# Altium schematic sheet Receiver.SchDoc
size A4
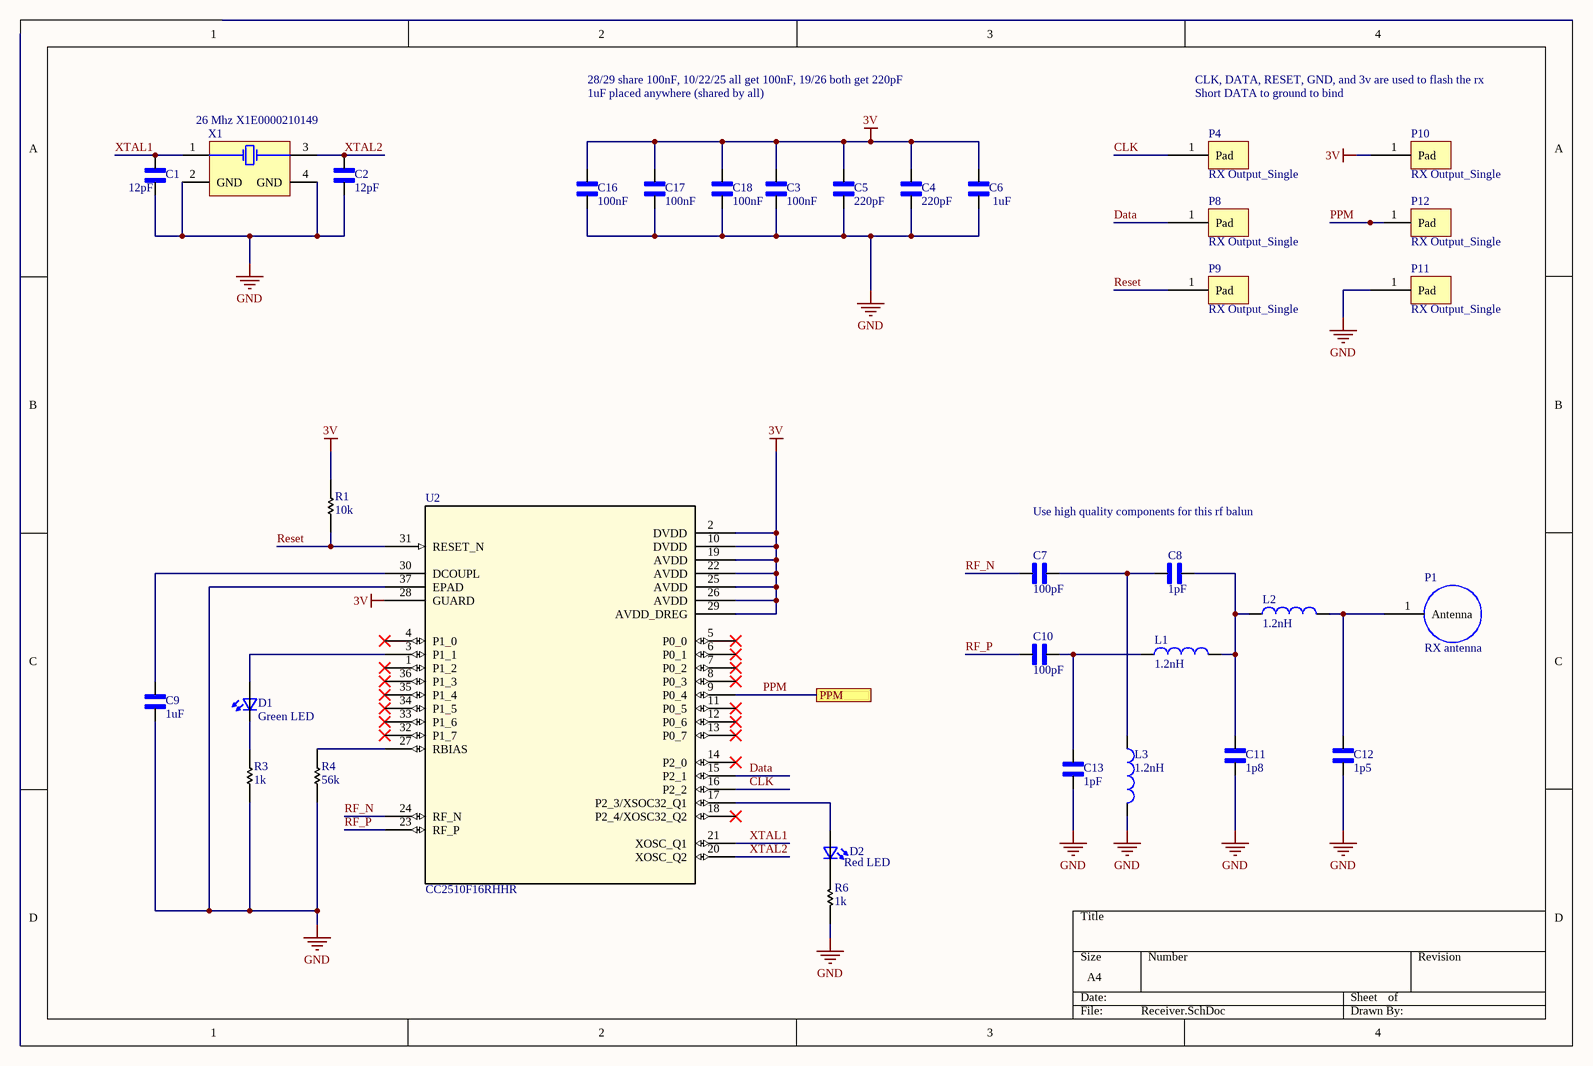
[diagram p0: Receiver.SchDoc]

## Parts
C1  12pF  [0402 Capacitor Generic]
C2  12pF  [0402 Capacitor Generic]
C3  100nF  [0402 Capacitor Generic]
C4  220pF  [0402 Capacitor Generic]
C5  220pF  [0402 Capacitor Generic]
C6  1uF  [0402 Capacitor Generic]
C7  100pF  [0402 Capacitor Generic]
C8  1pF  [0402 Capacitor Generic]
C9  1uF  [0402 Capacitor Generic]
C10  100pF  [0402 Capacitor Generic]
C11  1p8  [0402 Capacitor Generic]
C12  1p5  [0402 Capacitor Generic]
C13  1pF  [0402 Capacitor Generic]
C16  100nF  [0402 Capacitor Generic]
C17  100nF  [0402 Capacitor Generic]
C18  100nF  [0402 Capacitor Generic]
D1  Green LED  [0402 LED Generic]
D2  Red LED  [0402 LED Generic]
L1  1.2nH  [0402 Inductor Generic]
L2  1.2nH  [0402 Inductor Generic]
L3  1.2nH  [0402 Inductor Generic]
P1  RX antenna  [Antenna pad]
P4  RX Output_Single  [1 Solder Pad]
P8  RX Output_Single  [1 Solder Pad]
P9  RX Output_Single  [1 Solder Pad]
P10  RX Output_Single  [1 Solder Pad]
P11  RX Output_Single  [1 Solder Pad]
P12  RX Output_Single  [1 Solder Pad]
R1  10k  [0402 Resistor Generic]
R3  1k  [0402 Resistor Generic]
R4  56k  [0402 Resistor Generic]
R6  1k  [0402 Resistor Generic]
U2  CC2510F16RHHR  [CC2510F32RHHR]
X1  26 Mhz X1E0000210149  [TSX-3225]

## Ports
PPM

## Nets
3V: C3.1 C4.1 C5.1 C6.1 C16.1 C17.1 C18.1 P10.1(Pad) R1.1 U2.2(DVDD) U2.10(DVDD) U2.19(AVDD) U2.22(AVDD) U2.25(AVDD) U2.26(AVDD) U2.28(GUARD) U2.29(AVDD_DREG)
GND: C1.2 C2.2 C3.2 C4.2 C5.2 C6.2 C9.2 C11.2 C12.2 C13.2 C16.2 C17.2 C18.2 L3.2 P11.1(Pad) R3.2 R4.2 R6.2 U2.37(EPAD) X1.2(GND) X1.4(GND)
CLK: P4.1(Pad) U2.16(P2_2)
Data: P8.1(Pad) U2.15(P2_1)
PPM: P12.1(Pad) U2.9(P0_4) ; port PPM
Reset: P9.1(Pad) R1.2 U2.31(RESET_N)
RF_N: C7.2 U2.24(RF_N)
RF_P: C10.2 U2.23(RF_P)
XTAL1: C1.1 U2.21(XOSC_Q1) X1.1(X1)
XTAL2: C2.1 U2.20(XOSC_Q2) X1.3(X2)
NetC7_1: C7.1 C8.1 L3.1
NetC8_2: C8.2 C11.1 L1.2 L2.1
NetC9_1: C9.1 U2.30(DCOUPL)
NetC10_1: C10.1 C13.1 L1.1
NetC12_1: C12.1 L2.2 P1.1(Antenna)
NetD1_1: D1.1(K2) R3.1
NetD1_2: D1.2(A2) U2.3(P1_1)
NetD2_1: D2.1(K2) R6.1
NetD2_2: D2.2(A2) U2.17(P2_3/XSOC32_Q1)
NetR4_1: R4.1 U2.27(RBIAS)

Not connected (* = marked no-connect by the designer): U2 1(P1_2)* 4(P1_0)* 5(P0_0)* 6(P0_1)* 7(P0_2)* 8(P0_3)* 11(P0_5)* 12(P0_6)* 13(P0_7)* 14(P2_0)* 18(P2_4/XOSC32_Q2)* 32(P1_7)* 33(P1_6)* 34(P1_5)* 35(P1_4)* 36(P1_3)*

## Notes on the sheet
- 28/29 share 100nF, 10/22/25 all get 100nF, 19/26 both get 220pF
- 1uF placed anywhere (shared by all)
- CLK, DATA, RESET, GND, and 3v are used to flash the rx
- Short DATA to ground to bind
- Use high quality components for this rf balun

## Library data of the parts
C1-C13 C16-C18 = 0402 Ceramic Capacitor: Generic 0402 Ceramic Capacitor; MP: AC0402FR-071ML; MF: Yageo; Package: 1005 Yageo; SnapEDA_Link: https://www.snapeda.com/parts/AC0402FR-071ML/Yageo/view-part/940461/?ref=snap; Value: *; Mouser-Purchase-URL: https://snapeda.com/shop?store=Mouser&id=940461; DigiKey-Purchase-URL: https://snapeda.com/shop?store=DigiKey&id=940461
D1 D2 = 0402 Generic LED: Value: *
L1-L3 = 0402 Generic Inductor: Value: *
P1 = Generic Antenna
R1 R3 R4 R6 = 0402 Generic Resistor: Generic 0402 Resistor
U2 = CC2510F16RHHR: VQFN-36 RF Transceiver ICs; SourceLibrary: TI_2019-05-10; Vendor: Texas Instruments; Manufacturer_Part_Number: CC2510F16RHHR; RefDes: RefDes; Type: DEV
X1 = X1E0000210149: 26MHz ±10ppm 12pF 40Ω TSX-3225; Manufacturer: Epson; ESR (Equivalent Series Resistance): 40R; Supplier 1: Digi-Key; RoHS: Yes; Category: Crystals; Pricing 1: 2000=0.17600 (USD); Mount: Surface Mount; Case/Package: SMD/SMT; Min Operating Temperature: -20°C; Max Operating Temperature: 75°C; Packaging: Tape and Reel; Frequency: 26MHz; Load Capacitance: 12pF; Frequency Stability: 10ppm; Frequency Tolerance: 10ppm; Length: 0.126inch; Height: 0.024inch; Width: 0.098inch; ComponentLink1URL: https://support.epson.biz/td/api/doc_check.php?dl=brief_FA-238V_en.pdf&src-supplier=Digi-Key; ComponentLink1Description: https://support.epson.biz/td/api/doc_check.php?dl=brief_FA-238V_en.pdf&src-supplier=Digi-Key